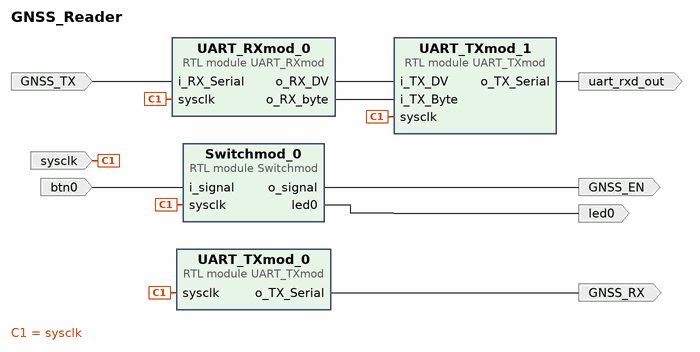
[diagram p0: block diagram of the top level]
# Vivado block design GNSS_Reader, xc7a35tcpg236-1, Vivado 2024.2
create_bd_design GNSS_Reader

create_bd_port -dir I sysclk
create_bd_port -dir I GNSS_TX
create_bd_port -dir O GNSS_RX
create_bd_port -dir O uart_rxd_out
create_bd_port -dir I btn0
create_bd_port -dir O GNSS_EN
create_bd_port -dir O led0

create_bd_cell -type module -reference UART_TXmod UART_TXmod_0
set_property -dict {CONFIG.Baud_Rate 9600} [get_bd_cells UART_TXmod_0]
create_bd_cell -type module -reference UART_RXmod UART_RXmod_0
set_property -dict {CONFIG.Baud_Rate 9600} [get_bd_cells UART_RXmod_0]
create_bd_cell -type module -reference UART_TXmod UART_TXmod_1
set_property -dict {CONFIG.Baud_Rate 115200} [get_bd_cells UART_TXmod_1]
create_bd_cell -type module -reference Switchmod Switchmod_0

# ---- connections ----

connect_bd_net [get_bd_pins Switchmod_0/led0] [get_bd_ports led0]
connect_bd_net [get_bd_pins Switchmod_0/o_signal] [get_bd_ports GNSS_EN]
connect_bd_net [get_bd_pins UART_RXmod_0/o_RX_DV] [get_bd_pins UART_TXmod_1/i_TX_DV]
connect_bd_net [get_bd_pins UART_RXmod_0/o_RX_byte] [get_bd_pins UART_TXmod_1/i_TX_Byte]
connect_bd_net [get_bd_pins UART_TXmod_0/o_TX_Serial] [get_bd_ports GNSS_RX]
connect_bd_net [get_bd_pins UART_TXmod_1/o_TX_Serial] [get_bd_ports uart_rxd_out]
connect_bd_net -net i_RX_Serial_0_1 [get_bd_ports GNSS_TX] [get_bd_pins UART_RXmod_0/i_RX_Serial]
connect_bd_net -net i_signal_0_1 [get_bd_ports btn0] [get_bd_pins Switchmod_0/i_signal]
connect_bd_net -net sysclk_0_1 [get_bd_ports sysclk] \
  [get_bd_pins UART_RXmod_0/sysclk] [get_bd_pins UART_TXmod_0/sysclk] [get_bd_pins UART_TXmod_1/sysclk] \
  [get_bd_pins Switchmod_0/sysclk]

validate_bd_design
save_bd_design
